# Altium schematic sheet 3_5G模块.SchDoc
size A4
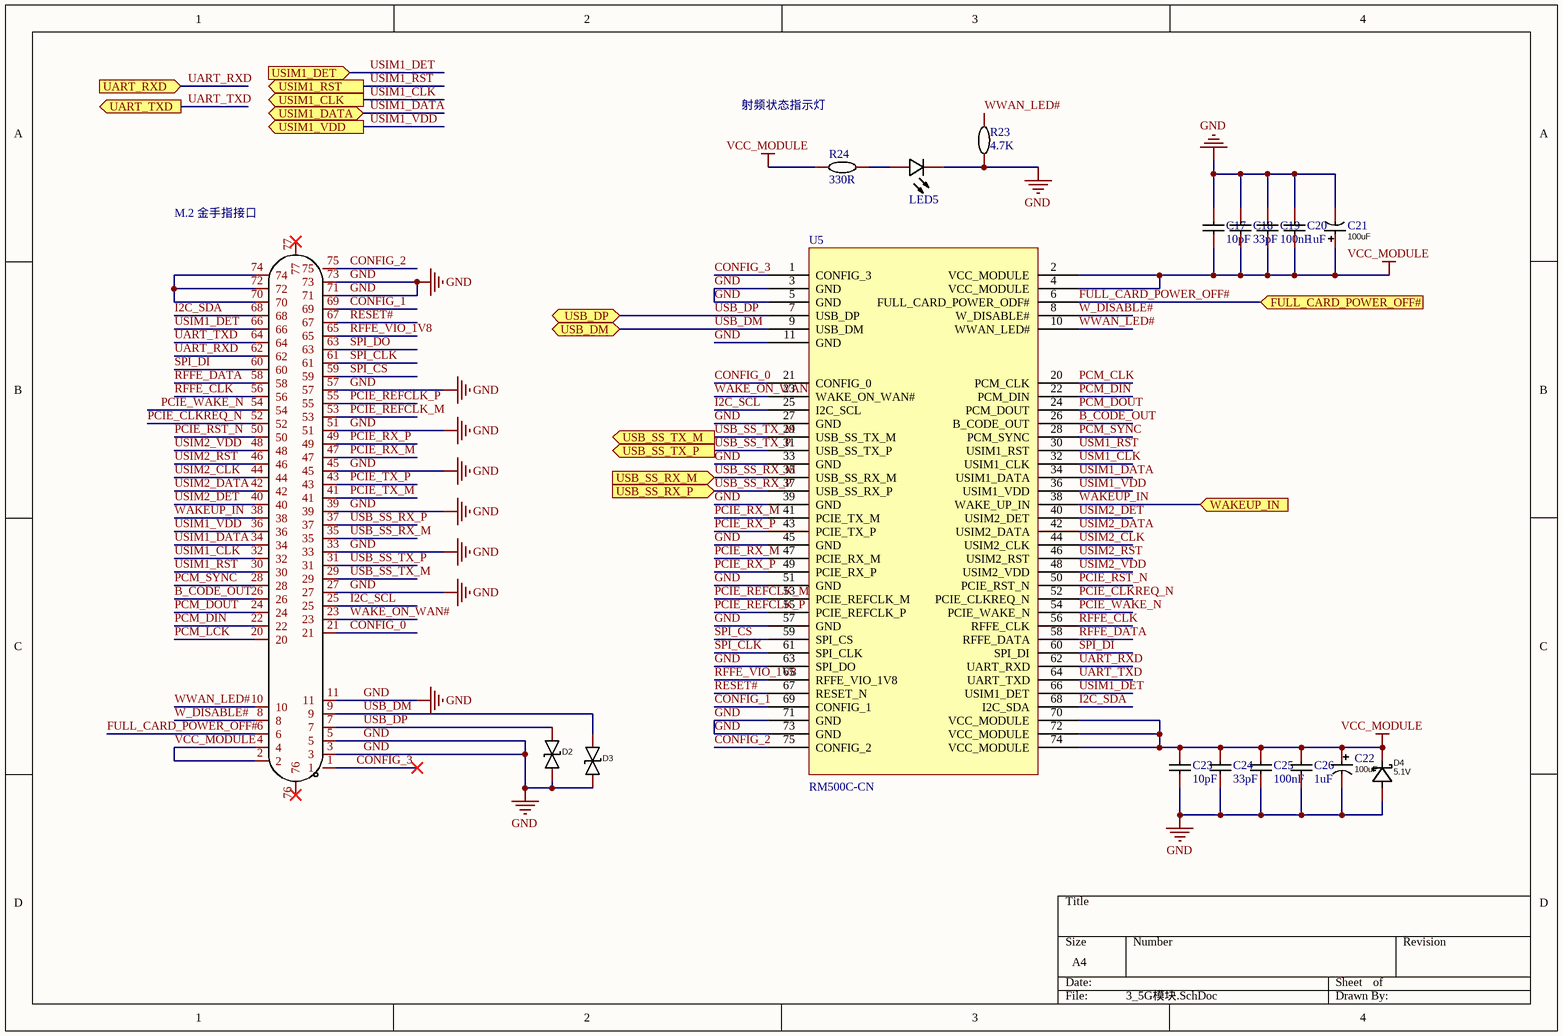
[diagram p0: 3_5G模块.SchDoc]

## Parts
C17  Name: 10pF  [0603C]  (hidden comment: 100nF)
C18  Name: 33pF  [0603C]  (hidden comment: 100nF)
C19  100nF  [0603C]
C20  Name: 1uF  [0603C]  (hidden comment: 100nF)
C21  100uF  [1206C]
C22  100uF  [1206C]
C23  Name: 10pF  [0603C]  (hidden comment: 100nF)
C24  Name: 33pF  [0603C]  (hidden comment: 100nF)
C25  100nF  [0603C]
C26  Name: 1uF  [0603C]  (hidden comment: 100nF)
CN3  APCI0078-P002A_C7498136  [NGFF-SMD_APCI0078-P002A]  (value not drawn)
D2  PESD3V3L1BA-N  [SOD-323_L1.8-W1.3-LS2.5-BI]  (value not drawn)
D3  PESD3V3L1BA-N  [SOD-323_L1.8-W1.3-LS2.5-BI]  (value not drawn)
D4  Reverse Stand-Off Voltage (Vrwm): 5.1V  [SOD-123FL_L2.8-W1.8-LS3.7-RD]  (hidden comment: SMF75A_C5116416)
LED5  NCD0603G1  [LED0603-RD]  (value not drawn)
R23  4.7K  [0603R]
R24  330R  [0402R]
U5  RM500C-CN

## Ports
FULL_CARD_POWER_OFF# (in), UART_RXD (in), UART_TXD (out), USB_DM (bidir), USB_DP (bidir), USB_SS_RX_M (in), USB_SS_RX_P (in), USB_SS_TX_M (out), USB_SS_TX_P (out), USIM1_CLK (out), USIM1_DATA (bidir), USIM1_DET (in), USIM1_RST (out), USIM1_VDD (out), WAKEUP_IN (in)

## Nets
GND: C17.1 C18.1 C19.1 C20.1 C21.2 C22.2 C23.1 C24.1 C25.1 C26.1 CN3.3 CN3.5 CN3.11 CN3.27 CN3.33 CN3.39 CN3.45 CN3.51 CN3.57 CN3.71 CN3.73 D2.1 D3.1 D4.2(A) LED5.1(C) R23.1 U5.3(GND) U5.5(GND) U5.11(GND) U5.27(GND) U5.33(GND) U5.39(GND) U5.45(GND) U5.51(GND) U5.57(GND) U5.63(SPI_DO) U5.71(GND) U5.73(GND)
VCC_MODULE: C17.2 C18.2 C19.2 C20.2 C21.1 C22.1 C23.2 C24.2 C25.2 C26.2 CN3.2 CN3.4 D4.1(K) R24.1 U5.2(VCC_MODULE) U5.4(VCC_MODULE) U5.70(VCC_MODULE) U5.72(VCC_MODULE) U5.74(VCC_MODULE)
B_CODE_OUT: CN3.26 U5.26(B_CODE_OUT)
CONFIG_0: CN3.21 U5.21(CONFIG_0)
CONFIG_1: CN3.69 U5.69(CONFIG_1)
CONFIG_2: CN3.75 U5.75(CONFIG_2)
CONFIG_3: CN3.1 U5.1(CONFIG_3)
FULL_CARD_POWER_OFF#: CN3.6 U5.6(FULL_CARD_POWER_ODF#) ; port FULL_CARD_POWER_OFF#
I2C_SCL: CN3.25 U5.25(I2C_SCL)
I2C_SDA: CN3.68 U5.68(I2C_SDA)
PCIE_CLKREQ_N: CN3.52 U5.52(PCIE_CLKREQ_N)
PCIE_REFCLK_M: CN3.53 U5.53(PCIE_REFCLK_M)
PCIE_REFCLK_P: CN3.55 U5.55(PCIE_REFCLK_P)
PCIE_RST_N: CN3.50 U5.50(PCIE_RST_N)
PCIE_RX_M: CN3.47 U5.41(PCIE_TX_M) U5.47(PCIE_RX_M)
PCIE_RX_P: CN3.49 U5.43(PCIE_TX_P) U5.49(PCIE_RX_P)
PCIE_TX_M: CN3.41
PCIE_TX_P: CN3.43
PCIE_WAKE_N: CN3.54 U5.54(PCIE_WAKE_N)
PCM_CLK: U5.20(PCM_CLK)
PCM_DIN: CN3.22 U5.22(PCM_DIN)
PCM_DOUT: CN3.24 U5.24(PCM_DOUT)
PCM_LCK: CN3.20
PCM_SYNC: CN3.28 U5.28(PCM_SYNC)
RESET#: CN3.67 U5.67(RESET_N)
RFFE_CLK: CN3.56 U5.56(RFFE_CLK)
RFFE_DATA: CN3.58 U5.58(RFFE_DATA)
RFFE_VIO_1V8: CN3.65 U5.65(RFFE_VIO_1V8)
SPI_CLK: CN3.61 U5.61(SPI_CLK)
SPI_CS: CN3.59 U5.59(SPI_CS)
SPI_DI: CN3.60 U5.60(SPI_DI)
SPI_DO: CN3.63
UART_RXD: CN3.62 U5.62(UART_RXD) ; port UART_RXD
UART_TXD: CN3.64 U5.64(UART_TXD) ; port UART_TXD
USB_DM: CN3.9 D3.2 U5.9(USB_DM) ; port USB_DM
USB_DP: CN3.7 D2.2 U5.7(USB_DP) ; port USB_DP
USB_SS_RX_M: CN3.35 U5.35(USB_SS_RX_M) ; port USB_SS_RX_M
USB_SS_RX_P: CN3.37 U5.37(USB_SS_RX_P) ; port USB_SS_RX_P
USB_SS_TX_M: CN3.29 U5.29(USB_SS_TX_M) ; port USB_SS_TX_M
USB_SS_TX_P: CN3.31 U5.31(USB_SS_TX_P) ; port USB_SS_TX_P
USIM1_CLK: CN3.32 ; port USIM1_CLK
USIM1_DATA: CN3.34 U5.34(USIM1_DATA) ; port USIM1_DATA
USIM1_DET: CN3.66 U5.66(USIM1_DET) ; port USIM1_DET
USIM1_RST: CN3.30 ; port USIM1_RST
USIM1_VDD: CN3.36 U5.36(USIM1_VDD) ; port USIM1_VDD
USIM2_CLK: CN3.44 U5.44(USIM2_CLK)
USIM2_DATA: CN3.42 U5.42(USIM2_DATA)
USIM2_DET: CN3.40 U5.40(USIM2_DET)
USIM2_RST: CN3.46 U5.46(USIM2_RST)
USIM2_VDD: CN3.48 U5.48(USIM2_VDD)
USM1_CLK: U5.32(USIM1_CLK)
USM1_RST: U5.30(USIM1_RST)
W_DISABLE#: CN3.8 U5.8(W_DISABLE#)
WAKE_ON_WAN#: CN3.23 U5.23(WAKE_ON_WAN#)
WAKEUP_IN: CN3.38 U5.38(WAKE_UP_IN) ; port WAKEUP_IN
WWAN_LED#: CN3.10 R23.2 U5.10(WWAN_LED#)
NetCN3_70: CN3.70 CN3.72 CN3.74
NetLED5_2: LED5.2(A) R24.2

Not connected (* = marked no-connect by the designer): CN3 76* 77*

## Notes on the sheet
- 射频状态指示灯
- (near CN3) M.2 金手指接口

## Library data of the parts
C17-C20 C23-C26 = 0603B104K500NT: Manufacturer: FH; Convert to PCB: yes; Origin Footprint: C0603; Symbol: 100nF; Device: 0603B104K500NT; Supplier: LCSC; Manufacturer Part: 0603B104K500NT; Supplier Part: C30926; JLCPCB Part Class: Extended Part; Add into BOM: yes
  C19 C25: Name: 100nF
C21 C22 = CL31A226KAHNNNE: Symbol: 22uF; Add into BOM: yes; Temperature Coefficient: X5R; Voltage Rated: 25V; Origin Footprint: CAP-TH_BD4.0-P1.50-D0.8-FD; Device: CL31A226KAHNNNE; Supplier Part: C12891; Manufacturer Part: CL31A226KAHNNNE; Supplier Footprint: 1206; JLCPCB Part Class: Extended Part; Datasheet: https://atta.szlcsc.com/upload/public/pdf/source/20160103/1457707667836.pdf; Supplier: LCSC; Convert to PCB: yes; Value: 100uF
CN3 = APCI0078-P002A_C7498136: Add into BOM: yes; Connector Type: M.2; Pitch: 0.5mm; Symbol: APCI0078-P002A_C7498136; Device: APCI0078-P002A_C7498136; Supplier: LCSC; Supplier Part: C7498136; Manufacturer Part: APCI0078-P002A; JLCPCB Part Class: Extended Part; Datasheet: https://atta.szlcsc.com/upload/public/pdf/source/20230918/968CC5EFA479112182B1AF662CC27BAA.pdf; Convert to PCB: yes; Number of Pins: 67P; Height Above Board: 3.2mm
D2 D3 = PESD3V3L1BA-N: Add into BOM: yes; Symbol: PESD3V3L1BA-N; Device: PESD3V3L1BA-N; Supplier: LCSC; Supplier Part: C316020; Manufacturer Part: PESD3V3L1BA-N; JLCPCB Part Class: Extended Part; LCSC Part Name: PESD3V3L1BA-N; Supplier Footprint: SOD-323; Datasheet: https://atta.szlcsc.com/upload/public/pdf/source/20181025/C316020_2B145715011D530A3B5DDCE0F9684BA2.pdf; Convert to PCB: yes
D4 = SMF75A_C5116416: Manufacturer Part: SMF75A; Add into BOM: yes; Maximum Clamping Voltage: 121V; Peak Pulse Current (Ipp)@10/1000us: 1.4A; Peak Pulse Power Dissipation (Ppp)@10/1000us: 200W; Breakdown Voltage: 92.1V; Reverse Leakage Current (Ir): 1uA; Symbol: SMF75A_C5116416; Device: SMF75A_C5116416; Supplier Part: C5116416; Supplier Footprint: SOD-123FL; JLCPCB Part Class: Extended Part; Datasheet: https://atta.szlcsc.com/upload/public/pdf/source/20220715/82D6503F9C43F0DF9BB8970EC229759F.pdf; Convert to PCB: yes
LED5 = NCD0603G1: Symbol: 19-217/GHC-YR1S2/3T; Add into BOM: yes; Luminous Intensity (IF=20mA): 300~900mcd@10mA; Dominant Wavelength / Coordinate rank: 515~530nm; Dominant Wavelength: 520nm~535nm; Peak Wavelength: 518nm; Forward Current: 20mA; Power Dissipation: 110mW; Device: NCD0603G1; Supplier Part: C84267; Manufacturer Part: NCD0603G1; Supplier Footprint: 0603; JLCPCB Part Class: Extended Part; Datasheet: https://atta.szlcsc.com/upload/public/pdf/source/20200820/C84267_04BA7703640BAC111D09F5EFB971FBF3.pdf; Supplier: LCSC; Convert to PCB: yes; Correlated Color Temperature - CCT(K): -; Luminous Flux/Radiant Flux: -; Diode Configuration: -; Color Temperature: -; Mounting Sytle: -; Name: NCD0603G1
R23 = RMC06034.7k5%N: Manufacturer: Tyohm; Convert to PCB: yes; Origin Footprint: R0603; Symbol: 4.7K; Device: RMC06034.7k5%N; Supplier: LCSC; Supplier Part: C269694; Manufacturer Part: RMC06034.7k5%N; JLCPCB Part Class: Extended Part; Add into BOM: yes; Name: 4.7K
R24 = 0402WGF1001TCE: Add into BOM: yes; Power(Watts): 62.5mW; Overload Voltage (Max): 50V; Device: 0402WGF1001TCE; Manufacturer Part: 0402WGF1001TCE; Supplier Footprint: 0402; JLCPCB Part Class: Basic Part; Datasheet: https://atta.szlcsc.com/upload/public/pdf/source/20200306/C422600_1E6D84923E4A46A82E41ADD87F860B5C.pdf; Supplier: LCSC; Convert to PCB: yes
U5 = RM500C: id: U?; 注释: RM500C-CN